# EAGLE schematic TransmitterSchematicP (EAGLE 7.5.0)
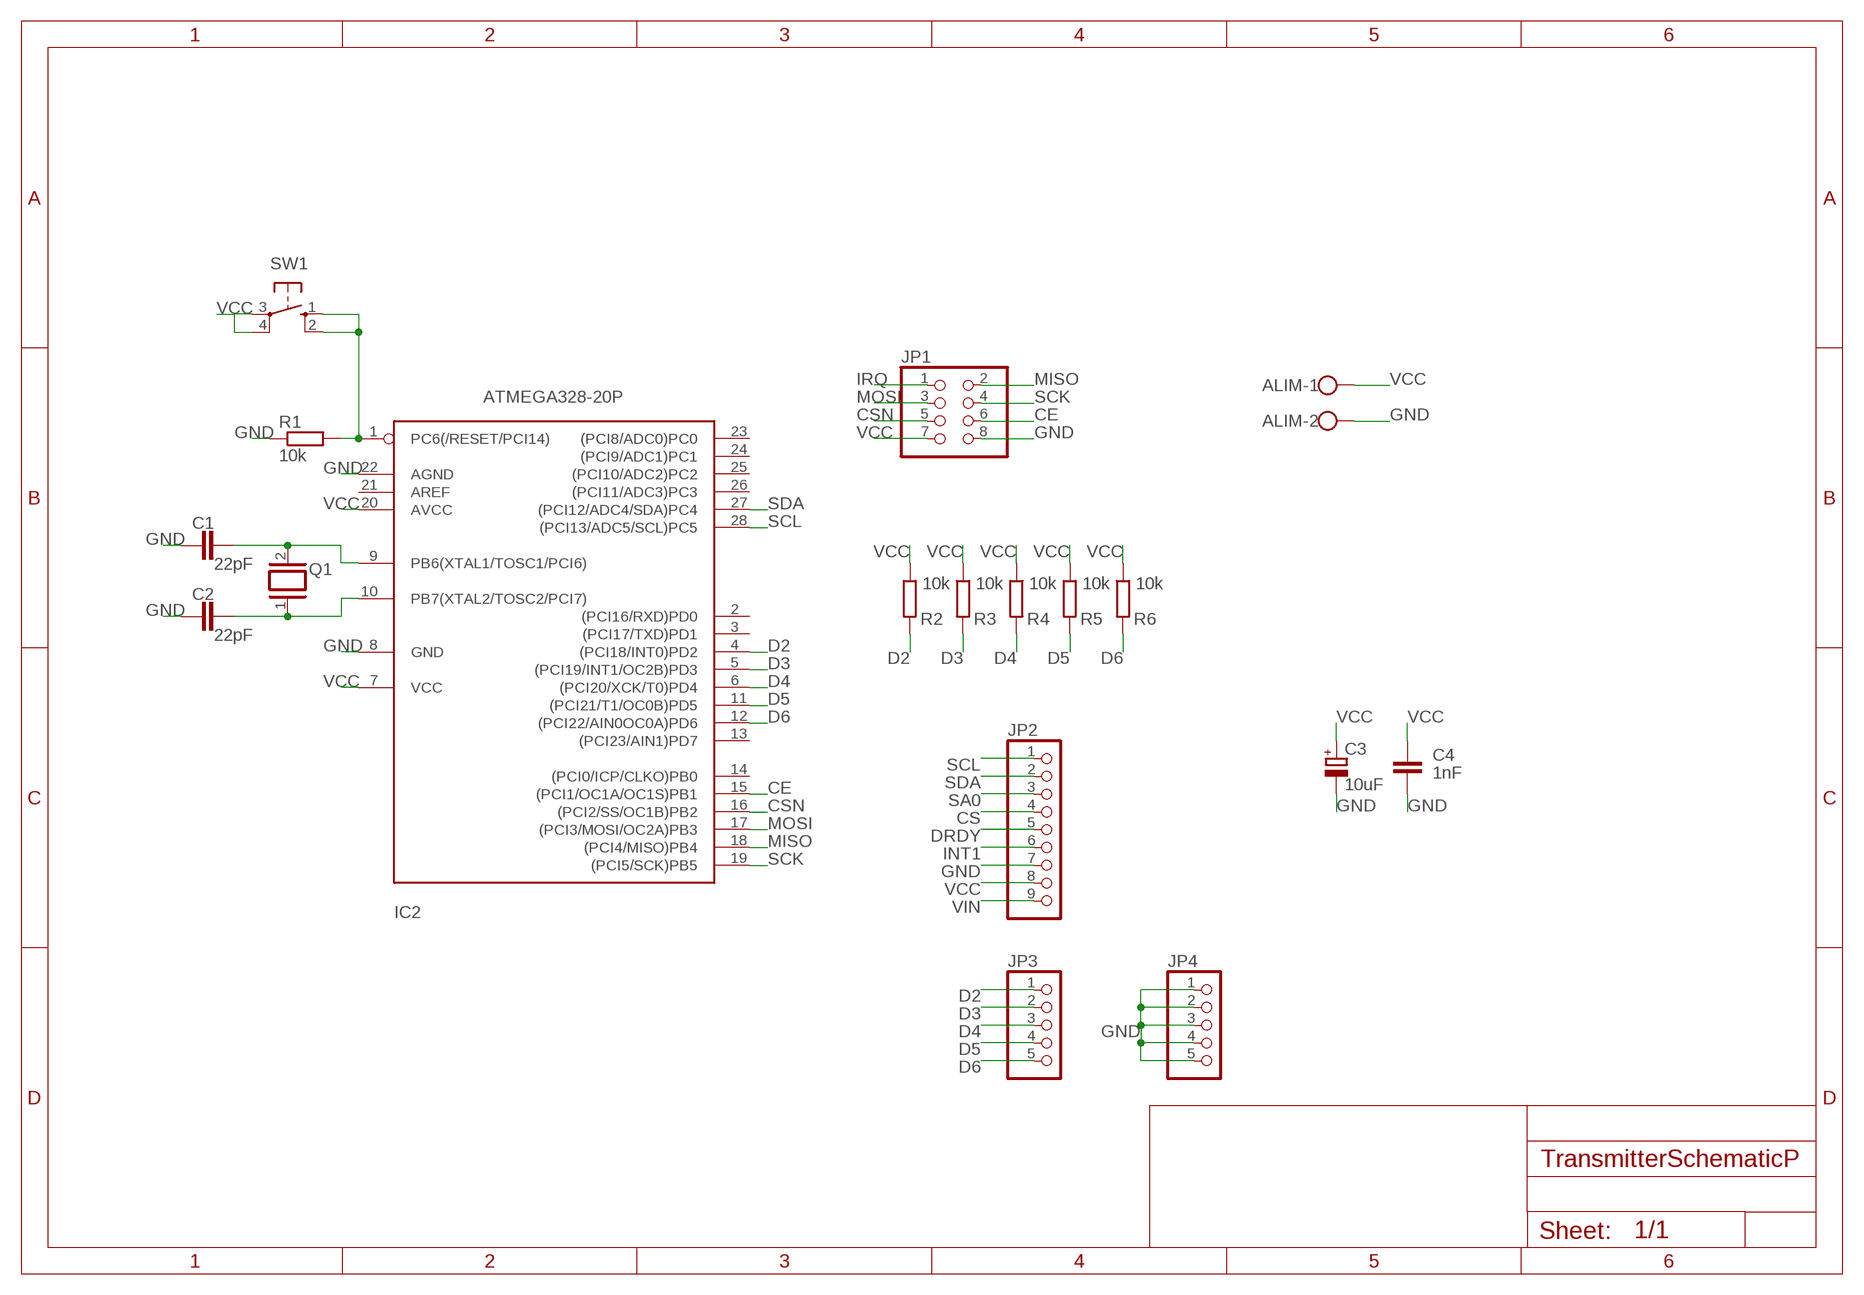
[diagram p0: schematic, sheet 1]

## Parts
ALIM  W237-102  [W237-102]
C1  22pF  C-EU050-024X044  [C050-024X044]
C2  22pF  C-EU050-024X044  [C050-024X044]
C3  10uF  CPOL-EUE2.5-5  [E2,5-5]
C4  1nF  C-EU050-024X044  [C050-024X044]
IC2  ATMEGA328-20P  [DIL28-3]
JP1  PINHD-2X4  [2X04]
JP2  PINHD-1X9  [1X09]
JP3  PINHD-1X5  [1X05]
JP4  PINHD-1X5  [1X05]
Q1  XTAL/S  [QS]
R1  10k  R-EU_0204/7  [0204/7]
R2  10k  R-EU_0204/7  [0204/7]
R3  10k  R-EU_0204/7  [0204/7]
R4  10k  R-EU_0204/7  [0204/7]
R5  10k  R-EU_0204/7  [0204/7]
R6  10k  R-EU_0204/7  [0204/7]
SW1  10-XX  [B3F-10XX]

## Nets
CE: IC2.15((PCI1/OC1A/OC1S)PB1) JP1.6
CS: JP2.4
CSN: IC2.16((PCI2/SS/OC1B)PB2) JP1.5
D2: IC2.4((PCI18/INT0)PD2) JP3.1 R2.2
D3: IC2.5((PCI19/INT1/OC2B)PD3) JP3.2 R3.2
D4: IC2.6((PCI20/XCK/T0)PD4) JP3.3 R4.2
D5: IC2.11((PCI21/T1/OC0B)PD5) JP3.4 R5.2
D6: IC2.12((PCI22/AIN0OC0A)PD6) JP3.5 R6.2
DRDY: JP2.5
GND: ALIM.2 C1.1 C2.1 C3.- C4.1 IC2.8(GND) IC2.22(AGND) JP1.8 JP2.7 JP4.1 JP4.2 JP4.3 JP4.4 JP4.5 R1.1
INT1: JP2.6
IRQ: JP1.1
MISO: IC2.18((PCI4/MISO)PB4) JP1.2
MOSI: IC2.17((PCI3/MOSI/OC2A)PB3) JP1.3
N$1: C1.2 IC2.9(PB6(XTAL1/TOSC1/PCI6)) Q1.2
N$2: C2.2 IC2.10(PB7(XTAL2/TOSC2/PCI7)) Q1.1
N$3: IC2.1(PC6(/RESET/PCI14)) R1.2 SW1.1(S) SW1.2(S1)
SA0: JP2.3
SCK: IC2.19((PCI5/SCK)PB5) JP1.4
SCL: IC2.28((PCI13/ADC5/SCL)PC5) JP2.1
SDA: IC2.27((PCI12/ADC4/SDA)PC4) JP2.2
VCC: ALIM.1 C3.+ C4.2 IC2.7(VCC) IC2.20(AVCC) JP1.7 JP2.8 R2.1 R3.1 R4.1 R5.1 R6.1 SW1.3(P) SW1.4(P1)
VIN: JP2.9
Unconnected: IC2.2((PCI16/RXD)PD0) IC2.3((PCI17/TXD)PD1) IC2.13((PCI23/AIN1)PD7) IC2.14((PCI0/ICP/CLKO)PB0) IC2.21(AREF) IC2.23((PCI8/ADC0)PC0) IC2.24((PCI9/ADC1)PC1) IC2.25((PCI10/ADC2)PC2) IC2.26((PCI11/ADC3)PC3)

## Library data of the parts
ALIM = con-wago-500:W237-102: WAGO SCREW CLAMP; MPN: 237-102; OC_FARNELL: unknown; OC_NEWARK: 70K9898
C1 C2 C4 = rcl:C-EU: CAPACITOR, European symbol
C3 = rcl:CPOL-EU: POLARIZED CAPACITOR, European symbol
IC2 = atmega328:ATMEGA328*P: MICROCONTROLLER 32 kBytes FLASH 2 kBytes SRAM 1 kBytes EEPROM USART 8-channel 10 bit ADC
JP1 = pinhead:PINHD-2X4: PIN HEADER
JP2 = pinhead:PINHD-1X9: PIN HEADER
JP3 JP4 = pinhead:PINHD-1X5: PIN HEADER
Q1 = special:XTAL/S: CRYSTAL
R1-R6 = rcl:R-EU_: RESISTOR, European symbol
SW1 = buttons:10-XX: OMRON SWITCH